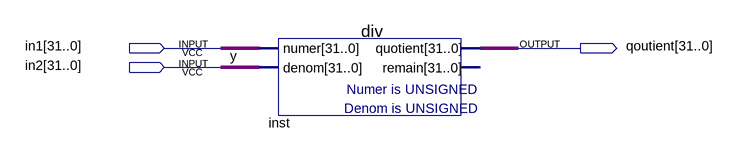
[diagram p0: schematic sheet]
// Quartus schematic div.bdf as structural Verilog: 1 symbols, 3 pins
module div (
  input  [31:0] in1,
  input  [31:0] in2,
  output [31:0] qoutient
);

  wire y;

  div inst (.numer(in1), .denom({32{y}}), .quotient(qoutient));  // open: remain
endmodule
